# EAGLE schematic main (EAGLE 9.6.2)
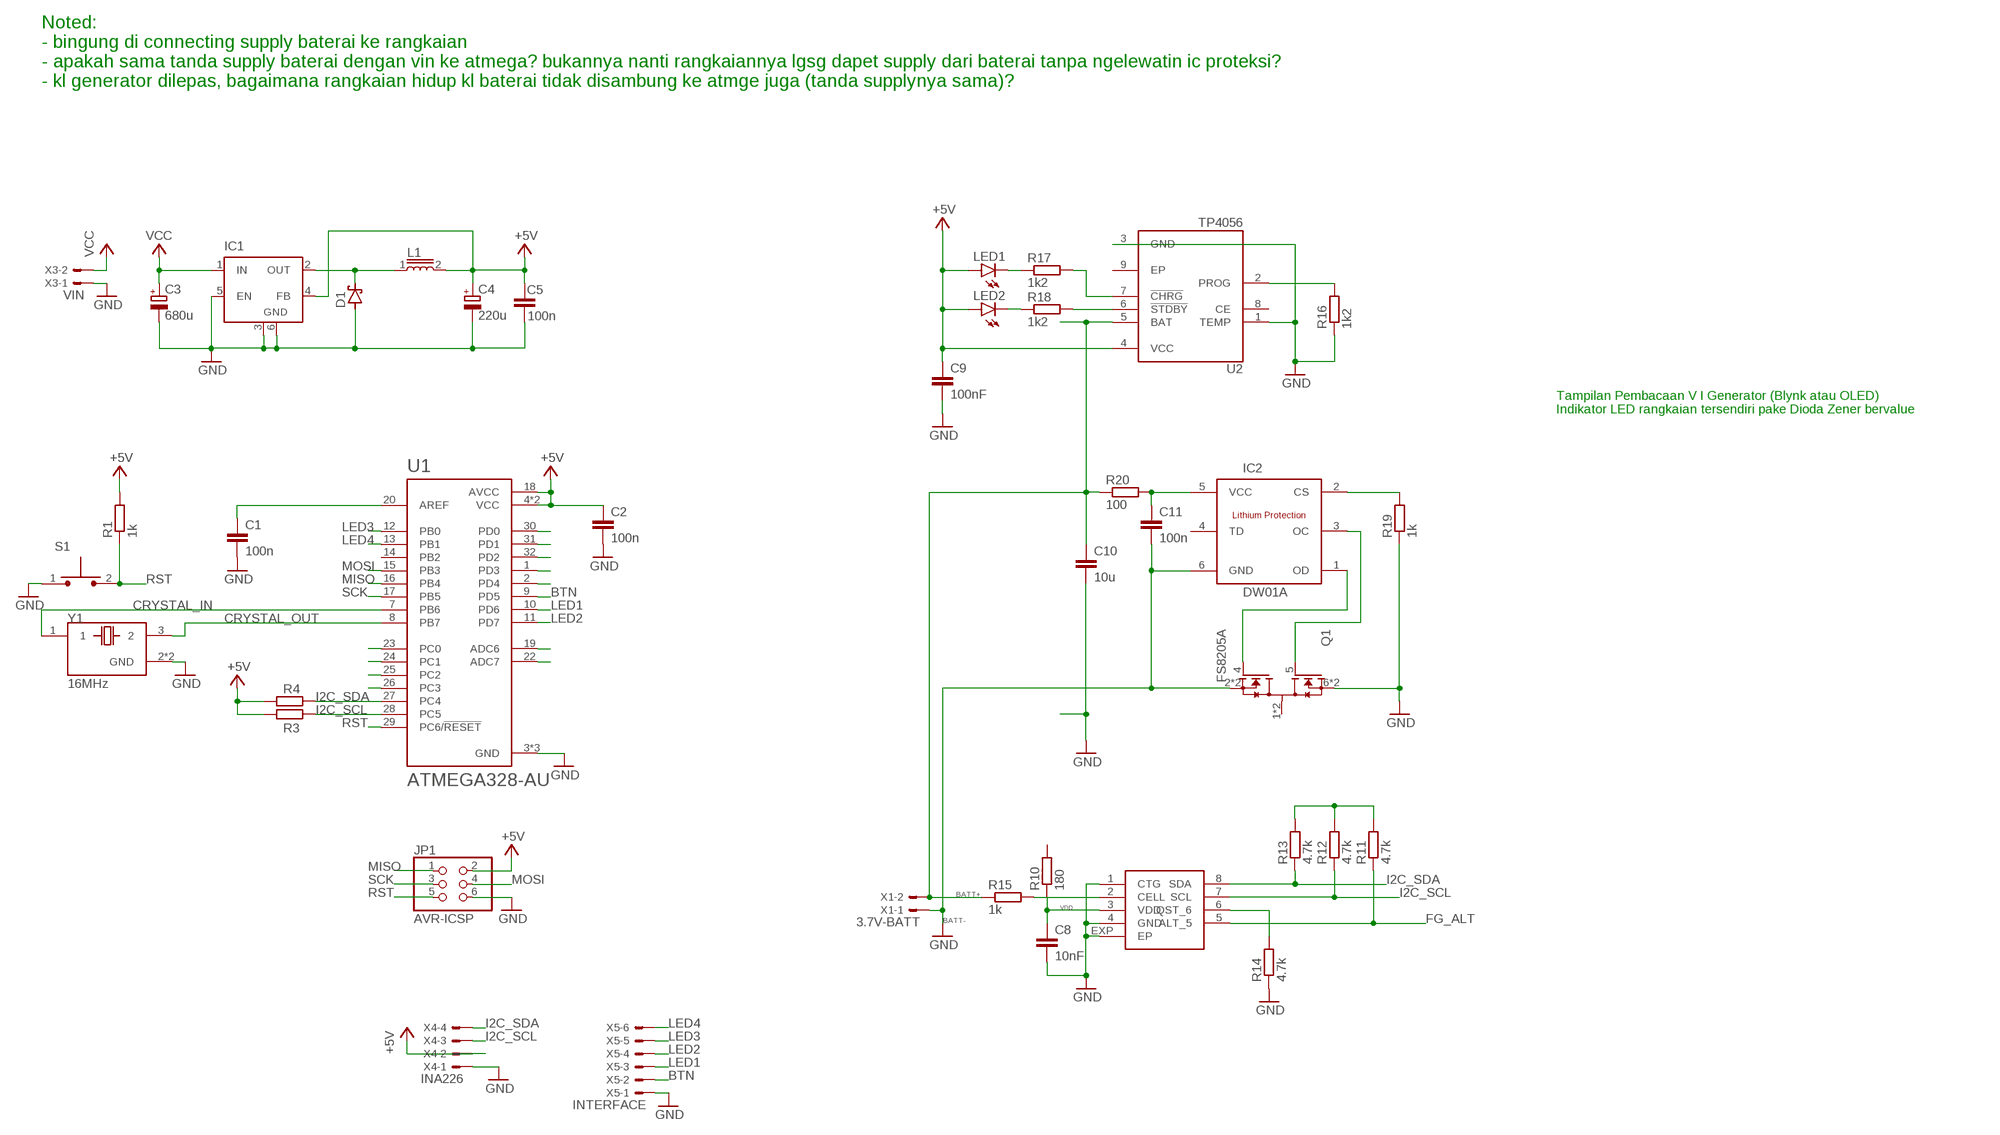
[diagram p0: schematic, sheet 1, part 1 of 2]
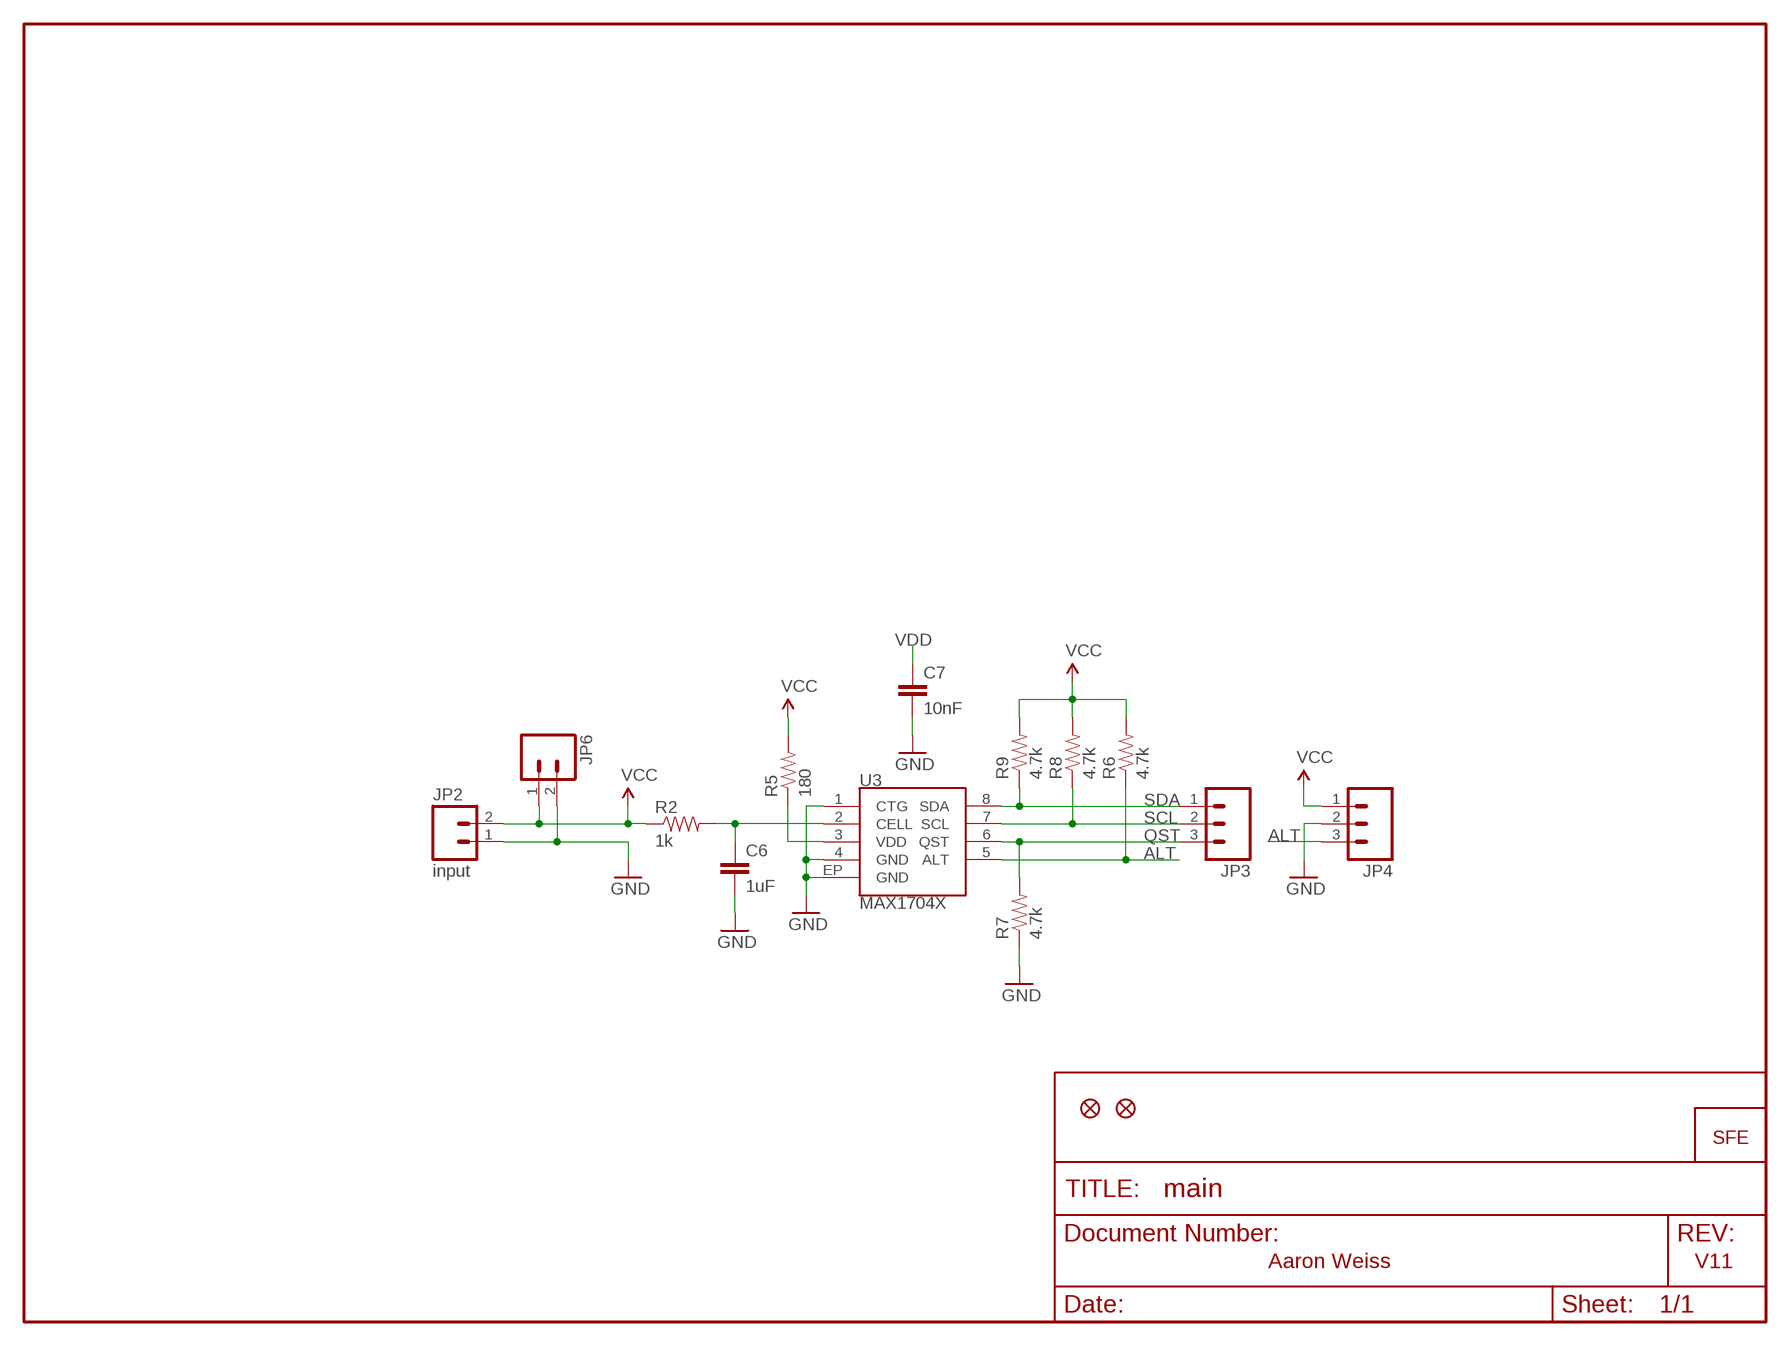
[diagram p1: schematic, sheet 1, part 2 of 2]

## Parts
C1  100n  C-EUC0805  [C0805]
C2  100n  C-EUC0805  [C0805]
C3  680u  CPOL-EU150CLZ-1010  [150CLZ-1010]
C4  220u  CPOL-EU150CLZ-0810  [150CLZ-0810]
C5  100n  C-EUC0805  [C0805]
C6  1uF  CAP0402-CAP  [0402-CAP]
C7  10nF  CAP0402-CAP  [0402-CAP]
C8  10nF  C-EUC0402  [C0402]
C9  100nF  C-EUC0603  [C0603]
C10  10u  C-EUC0603  [C0603]
C11  100n  C-EUC0603  [C0603]
D1  SCHOTTKY-DIODESMD  [SMB]
IC1  LM2596S  [TO263-5]
IC2  DW01A  [SOT23-6]
JP1  AVR-ICSP  PINHD-2X3  [2X03]
JP2  input  M02-JST-2MM-SMT  [JST-2-SMD]
JP3  M03PTH  [1X03]
JP4  M03PTH  [1X03]
JP5  LOGO-SFESK  [SFE-LOGO-FLAME]
JP6  M02PTH  [1X02]
JP7  FIDUCIAL1X2.5  [FIDUCIAL-1X2.5]
JP8  FIDUCIAL1X2.5  [FIDUCIAL-1X2.5]
L1  33uH  DR125-6R8-R  [INDM1250X1250X600]
LED1  LEDCHIPLED_0603  [CHIPLED_0603]
LED2  LEDCHIPLED_0603  [CHIPLED_0603]
Q1  FS8205A  [SOP65P640X120-8N]
R1  1k  R-EU_R0805  [R0805]
R2  1k  RESISTOR0402-RES  [0402-RES]
R3  R-EU_R0805  [R0805]
R4  R-EU_R0805  [R0805]
R5  180  RESISTOR0402-RES  [0402-RES]
R6  4.7k  RESISTOR0402-RES  [0402-RES]
R7  4.7k  RESISTOR0402-RES  [0402-RES]
R8  4.7k  RESISTOR0402-RES  [0402-RES]
R9  4.7k  RESISTOR0402-RES  [0402-RES]
R10  180  R-EU_R0402  [R0402]
R11  4.7k  R-EU_R0402  [R0402]
R12  4.7k  R-EU_R0402  [R0402]
R13  4.7k  R-EU_R0402  [R0402]
R14  4.7k  R-EU_R0402  [R0402]
R15  1k  R-EU_R0402  [R0402]
R16  1k2  R-EU_R0603  [R0603]
R17  1k2  R-EU_R0603  [R0603]
R18  1k2  R-EU_R0603  [R0603]
R19  1k  R-EU_R0603  [R0603]
R20  100  R-EU_R0603  [R0603]
S1  TL1015AF160QG  [SW_TL1015AF160QG]
U1  ATMEGA328-AU  [QFP80P900X900X120-32N]
U2  TP4056  [SOP127P600X175-9N]
U3  MAX1704X  [TDFN-8]
U$1  MAX17043  [DFN-2X3]
X1  3.7V-BATT  JST-XH-02-PIN-LONG-PAD  [JST-XH-02-PACKAGE-LONG-PAD]
X3  VIN  JST-XH-02-PIN-LONG-PAD  [JST-XH-02-PACKAGE-LONG-PAD]
X4  INA226  JST-XH-04-PIN-LONG-PAD  [JST-XH-04-PACKAGE-LONG-PAD]
X5  INTERFACE  JST-XH-06-PIN-LONG-PAD  [JST-XH-06-PACKAGE-LONG-PAD]
Y1  16MHz  TSX-3225_16.0000MF18X-AC3  [XTAL_TSX-3225_16.0000MF18X-AC3]

## Nets
+5V: C2.1 C4.+ C5.2 C9.1 IC1.4(FB) JP1.2 L1.2 LED1.A LED2.A R1.2 R3.1 R4.1 U1.4(VCC) U1.6(VCC) U1.18(AVCC) U2.4(VCC) X4.2
ALT: JP4.3 R6.1 U3.5(ALT)
BATT+: C10.1 R15.1 R20.1 U2.5(BAT) X1.2
BATT-: C11.2 IC2.6(GND) Q1.2(S1) Q1.3(S1) X1.1 ; supply symbol labelled GND
BTN: U1.9(PD5) X5.2
CRYSTAL_IN: U1.7(PB6) Y1.1
CRYSTAL_OUT: U1.8(PB7) Y1.3
FG_ALT: R11.1 U$1.5(ALT_5)
FG_QST: R14.2 U$1.6(QST_6)
GND: C1.2 C2.2 C3.- C4.- C5.1 C6.2 C7.2 C8.2 C9.2 C10.2 D1.A IC1.3(GND) IC1.5(EN) IC1.6(GND) JP1.6 JP2.1 JP4.2 JP6.2 Q1.6(S2) Q1.7(S2) R7.1 R14.1 R16.1 R19.1 S1.1 U1.3(GND) U1.5(GND) U1.21(GND) U2.1(TEMP) U2.3(GND) U3.1(CTG) U3.4(GND) U3.EP(GND) U$1.1(CTG) U$1.4(GND) U$1.EXP(EP) X3.1 X4.1 X5.1 Y1.2(GND) Y1.4(GND)
I2C_SCL: R3.2 R12.1 U1.28(PC5) U$1.7(SCL) X4.3
I2C_SDA: R4.2 R13.1 U1.27(PC4) U$1.8(SDA) X4.4
LED1: U1.10(PD6) X5.3
LED2: U1.11(PD7) X5.4
LED3: U1.12(PB0) X5.5
LED4: U1.13(PB1) X5.6
MAX_ALT: U1.32(PD2)
MISO: JP1.1 U1.16(PB4)
MOSI: JP1.4 U1.15(PB3)
N$1: U1.2(PD4)
N$2: C1.1 U1.20(AREF)
N$3: C6.1 R2.2 U3.2(CELL)
N$4: U1.30(PD0)
N$5: D1.C IC1.2(OUT) L1.1
N$6: R16.2 U2.2(PROG)
N$8: LED1.C R17.1
N$9: R15.2 U$1.2(CELL)
N$10: R17.2 U2.7(!CHRG)
N$11: U1.23(PC0)
N$12: U1.24(PC1)
N$13: U1.25(PC2)
N$14: U1.26(PC3)
N$15: U1.1(PD3)
N$16: R18.2 U2.6(!STDBY)
N$17: R11.2 R12.2 R13.2
N$18: U1.22(ADC7)
N$19: U1.19(ADC6)
N$20: LED2.C R18.1
N$22: IC2.2(CS) R19.2
N$23: IC2.1(OD) Q1.4(G1)
N$25: C11.1 IC2.5(VCC) R20.2
N$26: U1.31(PD1)
N$27: IC2.3(OC) Q1.5(G2)
QST: JP3.3 R7.2 U3.6(QST)
RST: JP1.5 R1.1 S1.2 U1.29(PC6/!RESET)
SCK: JP1.3 U1.17(PB5)
SCL: JP3.2 R8.1 U3.7(SCL)
SDA: JP3.1 R9.1 U3.8(SDA)
VCC: C3.+ IC1.1(IN) JP2.2 JP4.1 JP6.1 R2.1 R5.2 R6.2 R8.2 R9.2 X3.2
VDD: C7.1 C8.1 R5.1 R10.1 U3.3(VDD) U$1.3(VDD)
Unconnected: IC2.4(TD) Q1.1(D12) Q1.8(D12) R10.2 U1.14(PB2) U2.8(CE) U2.9(EP)

## Notes on the sheet
- Noted:
  - bingung di connecting supply baterai ke rangkaian
  - apakah sama tanda supply baterai dengan vin ke atmega? bukannya nanti rangkaiannya lgsg dapet supply dari baterai tanpa ngelewatin ic proteksi?
  - kl generator dilepas, bagaimana rangkaian hidup kl baterai tidak disambung ke atmge juga (tanda supplynya sama)?
- Tampilan Pembacaan V I Generator (Blynk atau OLED)
  Indikator LED rangkaian tersendiri pake Dioda Zener bervalue
- Aaron Weiss | V11

## Library data of the parts
C1 C2 C5 C8-C11 = rcl:C-EU: CAPACITOR, European symbol; SPICEPREFIX: C
C3 C4 = rcl:CPOL-EU: POLARIZED CAPACITOR, European symbol; SPICEPREFIX: C
C6 C7 = SparkFun:CAP: Capacitor Standard 0603 ceramic capacitor, and 0.1" leaded capacitor.
D1 = diode:SCHOTTKY-DIODE: Schottky Diode
IC1 = linear:LM2596S: STEP-DOWN VOLTAGE REGULATOR
IC2 = DW01A:DW01A: Check availability <https://pricing.snapeda.com/parts/DW01A/Fortune%20Semiconductor/view-part?ref=eda>; AVAILABILITY: Not in stock; DESCRIPTION: One Cell Lithium-ion/Polymer Battery Protection IC; MF: Fortune Semiconductor; MP: DW01A; PACKAGE: SOT-23-6 Fortune Semiconductor; PRICE: None
JP1 = pinhead:PINHD-2X3: PIN HEADER
JP2 JP6 = SparkFun:M02: Header 2 Standard 2-pin 0.1" header. Use with straight break away headers (SKU : PRT-00116), right angle break away headers (PRT-00553), swiss pins (PRT-00743), machine pins (PRT-00117), and female headers (PRT-00115). Molex polarized connector foot print use with SKU : PRT-08233 with associated crimp pins and housings.
JP3 JP4 = SparkFun:M03: Header 3 Standard 3-pin 0.1" header. Use with straight break away headers (SKU : PRT-00116), right angle break away headers (PRT-00553), swiss pins (PRT-00743), machine pins (PRT-00117), and female headers (PRT-00115). Molex polarized connector foot print use with SKU : PRT-08232 with associated crimp pins and housings.
JP5 = SparkFun:LOGO-SFE: Spark Fun Electronics PCB Logo This is the standard Spark Fun Electronics PCB logo.
JP7 JP8 = abes:FIDUCIAL: Fiducial Alignment Points Various fiducial points for machine vision alignment.
L1 = DR125-6R8-R:DR125-6R8-R: Inductor Power Shielded Drum Core 3.084u(OCL)H/3.3uH 20% 100KHz Ferrite 9.26A 6.3mOhm DCR T/R Check availability <https://pricing.snapeda.com/parts/DR125-6R8-R/Eaton/view-part?ref=eda>; AVAILABILITY: In Stock; DESCRIPTION: Inductor Power Shielded Drum Core 6.588u(OCL)H/6.8uH 20% 100KHz Ferrite 6.64A 12.3mOhm DCR T/R; MF: Eaton; MP: DR125-6R8-R; PACKAGE: Non Standard Coiltronics / Eaton; PRICE: None; PURCHASE-URL: https://pricing.snapeda.com/search/part/DR125-6R8-R/?ref=eda
LED1 LED2 = led:LED: LED OSRAM: - CHIPLED LG R971, LG N971, LY N971, LG Q971, LY Q971, LO R971, LY R971 LH N974, LH R974 LS Q976, LO Q976, LY Q976 LO Q996 - Hyper CHIPLED LW Q18S LB Q993, LB Q99A, LB R99A - SideLED LS A670, LO A670, LY A670, LG A670, LP A670 LB A673, LV A673, LT A673, LW A673 LH A674 LY A675 LS A676, LA A676, LO A676, LY A676, LW A676 LS A679, LY A679, LG A679 - Hyper Micro SIDELED® LS Y876, LA Y876, LO Y876, LY Y876 LT Y87S - SmartLED LW L88C, LW L88S LB L89C, LB L89S, LG L890 LS L89K, LO L89K, LY L89K LS L896, LA L896, LO L896, LY L896 - TOPLED LS T670, LO T670, LY T670, LG T670, LP T670 LSG T670, LSP T670, LSY T670, LOP T670, LYG T670 LG T671, LOG T671, LSG T671 LB T673, LV T673, LT T673, LW T673 LH T674 LS T676, LA T676, LO T676, LY T676, LB T676, LH T676, LSB T676, LW T676 LB T67C, LV T67C, LT T67C, LS T67K, LO T67K, LY T67K, LW E67C LS E67B, LA E67B, LO E67B, LY E67B, LB E67C, LV E67C, LT E67C LW T67C LS T679, LY T679, LG T679 LS T770, LO T770, LY T770, LG T770, LP T770 LB T773, LV T773, LT T773, LW T773 LH T774 LS E675, LA E675, LY E675, LS T675 LS T776, LA T776, LO T776, LY T776, LB T776 LHGB T686 LT T68C, LB T68C - Hyper Mini TOPLED® LB M676 - Mini TOPLED Santana® LG M470 LS M47K, LO M47K, LY M47K Source: http://www.osram.convergy.de LUXEON: - LUMILED® LXK2-PW12-R00, LXK2-PW12-S00, LXK2-PW14-U00, LXK2-PW14-V00 LXK2-PM12-R00, LXK2-PM12-S00, LXK2-PM14-U00 LXK2-PE12-Q00, LXK2-PE12-R00, LXK2-PE12-S00, LXK2-PE14-T00, LXK2-PE14-U00 LXK2-PB12-K00, LXK2-PB12-L00, LXK2-PB12-M00, LXK2-PB14-N00, LXK2-PB14-P00, LXK2-PB14-Q00 LXK2-PR12-L00, LXK2-PR12-M00, LXK2-PR14-Q00, LXK2-PR14-R00 LXK2-PD12-Q00, LXK2-PD12-R00, LXK2-PD12-S00 LXK2-PH12-R00, LXK2-PH12-S00 LXK2-PL12-P00, LXK2-PL12-Q00, LXK2-PL12-R00 Source: www.luxeon.com KINGBRIGHT: KA-3528ASYC Source: www.kingbright.com
Q1 = FS8205A:FS8205A: N/A Check availability <https://pricing.snapeda.com/parts/FS8205A/Fortune%20Semiconductor/view-part?ref=eda>; AVAILABILITY: Not in stock; MF: Fortune Semiconductor; MP: FS8205A; PACKAGE: Package; PRICE: None
R1 R3 R4 R10-R20 = rcl:R-EU_: RESISTOR, European symbol; SPICEPREFIX: R
R2 R5-R9 = SparkFun:RESISTOR: Resistor Basic schematic elements and footprints for 0603, 1206, and PTH resistors.
S1 = TL1015AF160QG:TL1015AF160QG: Tactile Switch SPST-NO Top Actuated Surface Mount Check prices <https://pricing.snapeda.com/parts/TL1015AF160QG/E-Switch/view-part?ref=eda>; AVAILABILITY: In Stock; DESCRIPTION: Tactile Switch SPST-NO Top Actuated Surface Mount; MF: E-Switch; MP: TL1015AF160QG; PACKAGE: SOIC-14 E-Switch; PRICE: None; PURCHASE-URL: https://pricing.snapeda.com/search/part/TL1015AF160QG/?ref=eda
U1 = ATMEGA328-AU:ATMEGA328-AU: ATmega Series 20 MHz 32 KB Flash 2 KB SRAM 8-Bit Microcontroller - TQFP-32 Check availability <https://pricing.snapeda.com/parts/ATMEGA328-AU/Microchip/view-part?ref=eda>; AVAILABILITY: Not in stock; DESCRIPTION: AVR AVR® ATmega Microcontroller IC 8-Bit 20MHz 32KB (16K x 16) FLASH 32-TQFP (7x7); MF: Microchip; MP: ATMEGA328-AU; PACKAGE: TQFP-32 Microchip; PRICE: None
U2 = TP4056:TP4056: Complete single cell Li-Ion battery with a constant current / constant voltage linear charger Check availability <https://pricing.snapeda.com/parts/TP4056/NanJing%20Top%20Power%20ASIC%20Corp./view-part?ref=eda>; AVAILABILITY: Not in stock; DESCRIPTION: Complete single cell Li-Ion battery with a constant current / constant voltage linear charger; MF: NanJing Top Power ASIC Corp.; MP: TP4056; PACKAGE: None; PRICE: None
U3 = SparkFun:MAX1704X: MAX17043/MAX17044: Battery Fuel Guage (43 is 1cell, 44 is 2cell)
U$1 = MAX17043:MAX17043
X1 X3 = Rembrandt Electronics - JST XH Connectors v1-0-2-2-2-2:JST-XH-02-PIN: JST XH Connector 2 Pin Wire to board connector. Pitch: 2,54 mm, (0.100") Number of pins: 2 Created by Rembrandt Electronics www.rembrandtelectronics.com
X4 = Rembrandt Electronics - JST XH Connectors v1-0-2-2-2-2:JST-XH-04-PIN: JST XH Connector 2 Pin Wire to board connector. Pitch: 2,54 mm, (0.100") Number of pins: 4 Created by Rembrandt Electronics www.rembrandtelectronics.com
X5 = Rembrandt Electronics - JST XH Connectors v1-0-2-2-2-2:JST-XH-06-PIN: JST XH Connector 2 Pin Wire to board connector. Pitch: 2,54 mm, (0.100") Number of pins: 6 Created by Rembrandt Electronics www.rembrandtelectronics.com
Y1 = TSX-3225_16.0000MF18X-AC3:TSX-3225_16.0000MF18X-AC3: SMD Crystal 16MHz-9pF-10ppm-60R; Check prices <https://pricing.snapeda.com/parts/TSX-3225%2016.0000MF18X-AC3/EPSON/view-part?ref=eda>; AVAILABILITY: Warning; DESCRIPTION: 16MHz ±10ppm Crystal 9pF 60 Ohms 4-SMD, No Lead; MF: EPSON; MP: TSX-3225 16.0000MF18X-AC3; PACKAGE: SMD-4 EPSON; PRICE: None; PURCHASE-URL: https://pricing.snapeda.com/search/part/TSX-3225 16.0000MF18X-AC3/?ref=eda